# Altium schematic sheet dgainblock.SchDoc
size A1
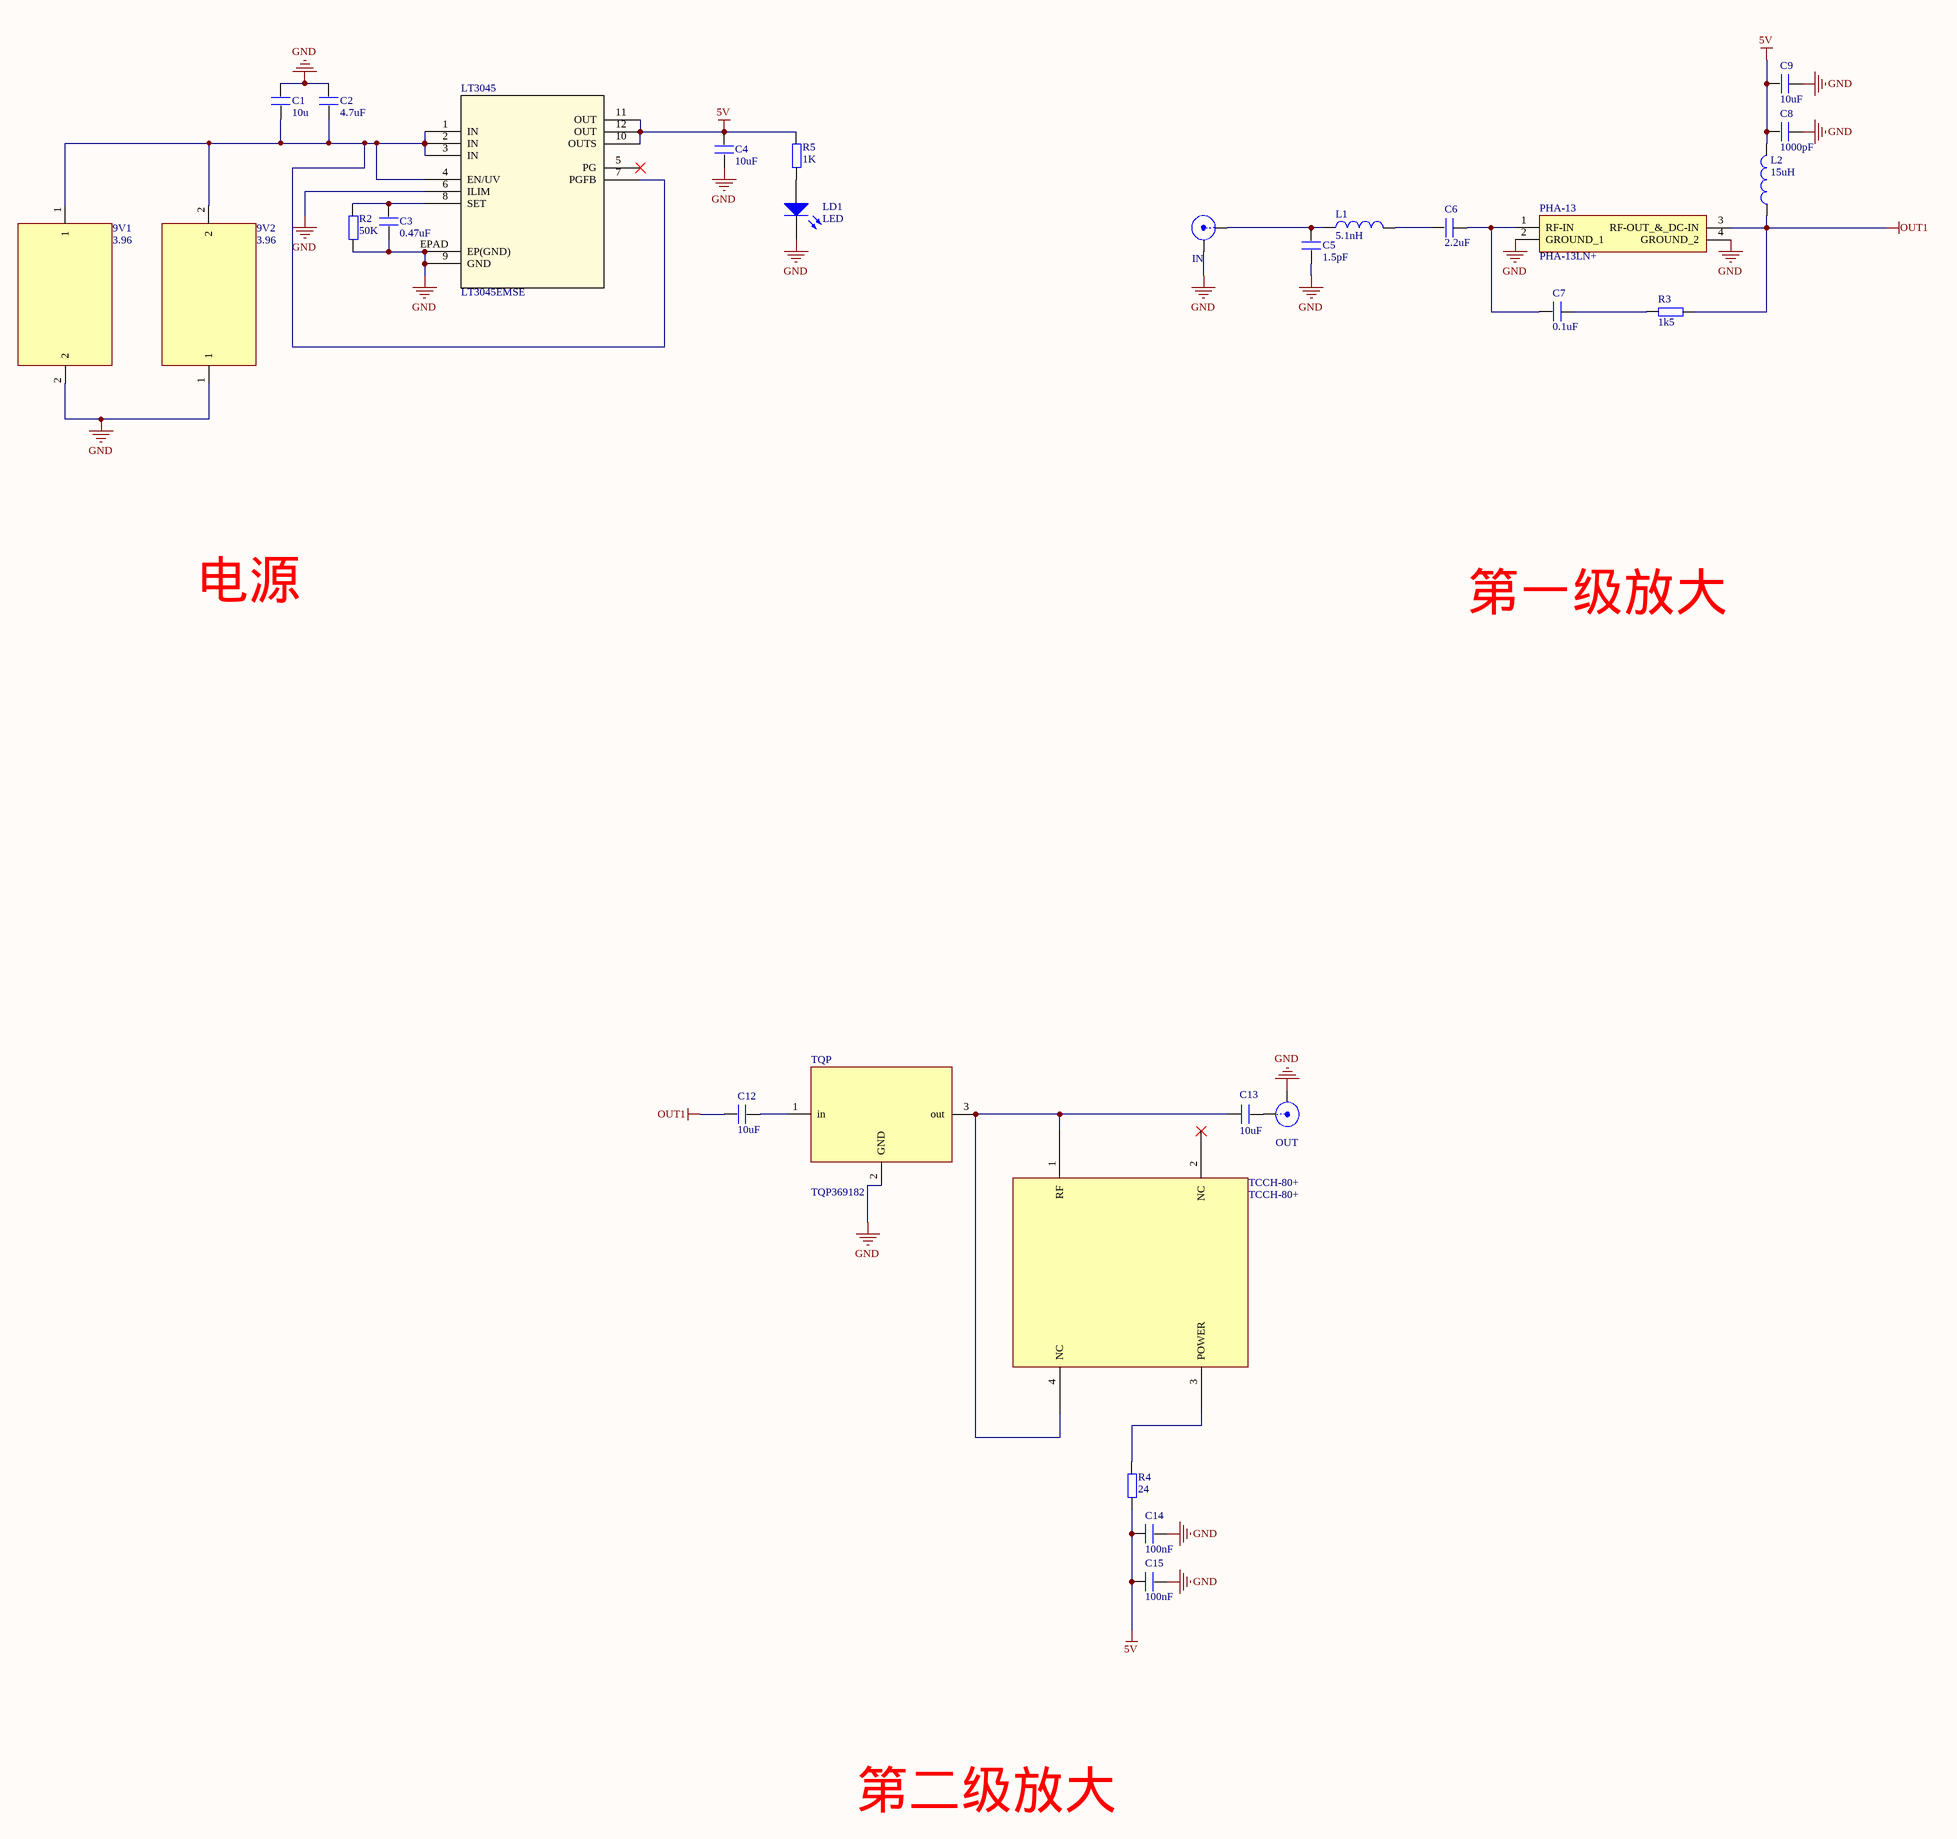
[diagram p0: dgainblock.SchDoc]

## Parts
9V1  3.96  [3.96]
9V2  3.96  [3.96]
C1  10u  [0603C]
C2  4.7uF  [0603C]
C3  0.47uF  [0402]
C4  10uF  [0402]
C5  1.5pF  [0402]
C6  2.2uF  [0402]
C7  0.1uF  [0402]
C8  1000pF  [0402]
C9  10uF  [0603C]
C12  10uF  [0402]
C13  10uF  [0402]
C14  100nF  [0603C]
C15  100nF  [0603C]
IN  SMA  [SMA]  (value not drawn)
L1  5.1nH  [0402]
L2  15uH  [C1210-L]
LD1  LED  [SMDLED]
LT3045  LT3045EMSE  [MSOP12-MSE-RevG_ADI]
OUT  SMA  [SMA]  (value not drawn)
PHA-13  PHA-13LN+  [PHA13LN]
R2  50K  [0402]
R3  1k5  [0402]
R4  24  [1206]
R5  1K  [0603R]
TCCH-80+  TCCH-80+  [GU1604]
TQP  TQP369182  [SOT89_M]

## Nets
5V: C4.2 C8.2 C9.2 C14.1 C15.1 L2.2 LT3045.10(OUTS) LT3045.11(OUT) LT3045.12(OUT) R4.1 R5.2
GND: 9V1.2 9V2.1 C1.2 C2.2 C3.1 C4.1 C5.1 C8.1 C9.1 C14.2 C15.2 IN.2(Y) LD1.2(K) LT3045.6(ILIM) LT3045.9(GND) LT3045.EPAD(EP(GND)) OUT.2(Y) PHA-13.2(GROUND_1) PHA-13.4(GROUND_2) R2.1 TQP.2(GND)
OUT1: C12.1 L2.1 PHA-13.3(RF-OUT_&_DC-IN) R3.2
Net9V1_1: 9V1.1 9V2.2 C1.1 C2.1 LT3045.1(IN) LT3045.2(IN) LT3045.3(IN) LT3045.4(EN/UV) LT3045.7(PGFB)
NetC3_2: C3.2 LT3045.8(SET) R2.2
NetC5_2: C5.2 IN.1(X) L1.1
NetC6_1: C6.1 C7.2 PHA-13.1(RF-IN)
NetC6_2: C6.2 L1.2
NetC7_1: C7.1 R3.1
NetC12_2: C12.2 TQP.1(in)
NetC13_1: C13.1 TCCH-80+.1(RF) TCCH-80+.4(NC) TQP.3(out)
NetC13_2: C13.2 OUT.1(X)
NetLD1_1: LD1.1(A) R5.1
NetR4_2: R4.2 TCCH-80+.3(POWER)

Not connected (* = marked no-connect by the designer): LT3045 5(PG)*; TCCH-80+ 2(NC)*

## Notes on the sheet
- 电源
- 第一级放大
- 第二级放大

## Library data of the parts
C1-C9 C12-C15 = C: Capacitor
IN OUT = SMA: SMA Connector
L1 L2 = Inductor: Value: 100uH; Published: 8-Jun-2000; Revision: July-2002: Re-released for DXP Platform.; Publisher: Altium Limited
LD1 = LED: Typical RED, GREEN, YELLOW, AMBER GaAs LED; Published: 8-Jun-2000; LatestRevisionDate: 17-Jul-2002; LatestRevisionNote: Re-released for DXP Platform.; PackageDocument: Feb-2002; PackageReference: 3.2X1.6X1.1; Publisher: Altium Limited
LT3045 = LT3045EMSE: No Description Available; SourceLibrary: Analog_Devices_Inc_2020-09-15; Built_By: SunStream; Vendor: Analog Devices Inc; Copyright: Copyright (C) 2018 Accelerated Designs. All rights reserved; Manufacturer_Part_Number: LT3045EMSE; RefDes: RefDes; Type: DEV
PHA-13 = PHA-13LN+: Integrated Circuit; Manufacturer_Name: Mini-Circuits; Datasheet Link: https://www.minicircuits.com/pdfs/PHA-13LN+.pdf; Height: 1.6mm; Manufacturer_Part_Number: PHA-13LN+; Mouser Part Number: 139-PHA-13LN; Mouser Price/Stock: https://www.mouser.co.uk/ProductDetail/Mini-Circuits/PHA-13LN%2b?qs=xZ%2FP%252Ba9zWqYkwnUBoTp7PQ%3D%3D
R2-R5 = Resistor